# Altium schematic sheet rev1.SchDoc
size A4
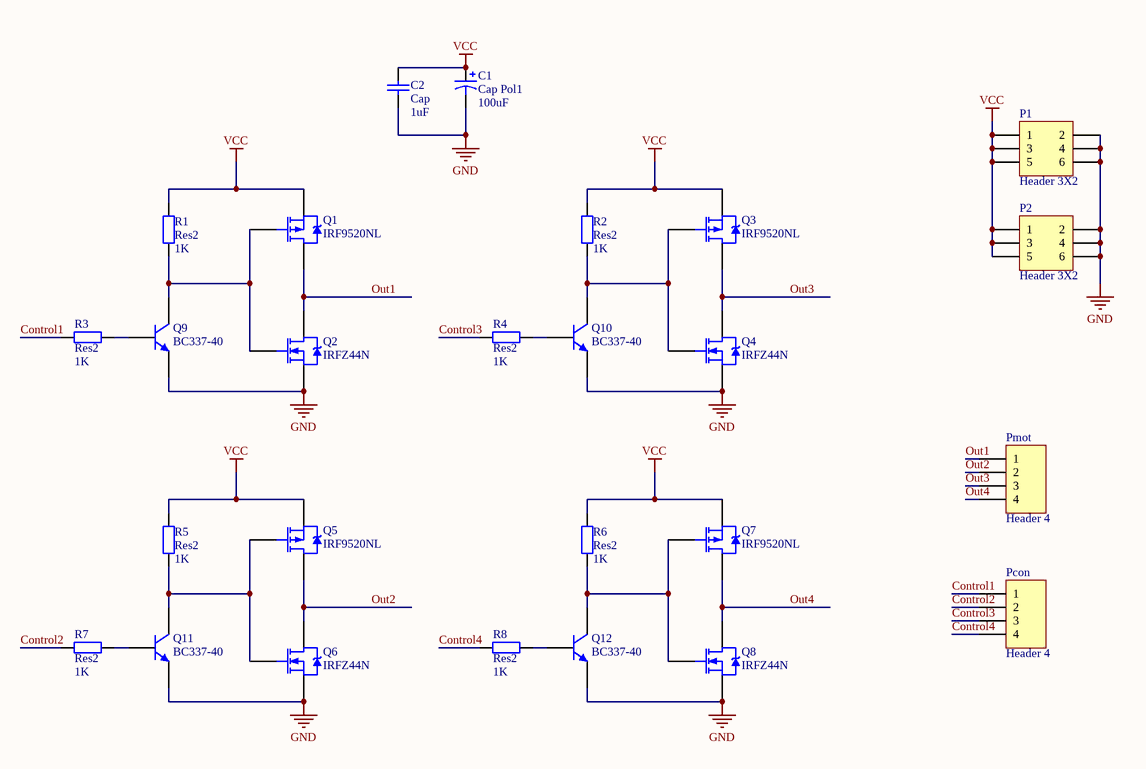
[diagram p0: rev1.SchDoc]

## Parts
C1  Cap Pol1  value 100uF  [RB5-10.5]
C2  Cap  value 1uF  [RAD-0.2]
P1  Header 3X2  [HDR2X3]
P2  Header 3X2  [HDR2X3]
Pcon  Header 4  [HDR1X4]
Pmot  Header 4  [HDR1X4]
Q1  IRF9520NL  [TO-262]
Q2  IRFZ44N  [TO-220AB]
Q3  IRF9520NL  [TO-262]
Q4  IRFZ44N  [TO-220AB]
Q5  IRF9520NL  [TO-262]
Q6  IRFZ44N  [TO-220AB]
Q7  IRF9520NL  [TO-262]
Q8  IRFZ44N  [TO-220AB]
Q9  BC337-40  [29-04]
Q10  BC337-40  [29-04]
Q11  BC337-40  [29-04]
Q12  BC337-40  [29-04]
R1  Res2  value 1K  [AXIAL-0.4]
R2  Res2  value 1K  [AXIAL-0.4]
R3  Res2  value 1K  [AXIAL-0.4]
R4  Res2  value 1K  [AXIAL-0.4]
R5  Res2  value 1K  [AXIAL-0.4]
R6  Res2  value 1K  [AXIAL-0.4]
R7  Res2  value 1K  [AXIAL-0.4]
R8  Res2  value 1K  [AXIAL-0.4]

## Nets
GND: C1.2 C2.1 P1.2 P1.4 P1.6 P2.2 P2.4 P2.6 Q2.3(S) Q4.3(S) Q6.3(S) Q8.3(S) Q9.3(E) Q10.3(E) Q11.3(E) Q12.3(E)
VCC: C1.1 C2.2 P1.1 P1.3 P1.5 P2.1 P2.3 P2.5 Q1.3(S) Q3.3(S) Q5.3(S) Q7.3(S) R1.2 R2.2 R5.2 R6.2
Control1: Pcon.1 R3.2
Control2: Pcon.2 R7.2
Control3: Pcon.3 R4.2
Control4: Pcon.4 R8.2
Out1: Pmot.1 Q1.2(D) Q2.2(D)
Out2: Pmot.2 Q5.2(D) Q6.2(D)
Out3: Pmot.3 Q3.2(D) Q4.2(D)
Out4: Pmot.4 Q7.2(D) Q8.2(D)
NetQ1_1: Q1.1(G) Q2.1(G) Q9.1(C) R1.1
NetQ3_1: Q3.1(G) Q4.1(G) Q10.1(C) R2.1
NetQ5_1: Q5.1(G) Q6.1(G) Q11.1(C) R5.1
NetQ7_1: Q7.1(G) Q8.1(G) Q12.1(C) R6.1
NetQ9_2: Q9.2(B) R3.1
NetQ10_2: Q10.2(B) R4.1
NetQ11_2: Q11.2(B) R7.1
NetQ12_2: Q12.2(B) R8.1

## Library data of the parts
C1 = Cap Pol1: Polarized Capacitor (Radial); Published: 8-Jun-2000; LatestRevisionDate: 17-Jul-2002; LatestRevisionNote: Re-released for DXP Platform.; PackageReference: RB7.6-15; Publisher: Altium Limited; PackageDescription: Polarized Capacitor (Radial); 2 Leads
C2 = Cap: Capacitor; Published: 8-Jun-2000; LatestRevisionDate: 17-Jul-2002; LatestRevisionNote: Re-released for DXP Platform.; PackageReference: RAD-0.3; Publisher: Altium Limited; PackageDescription: Radial Cap, Thru-Hole; 2 Leads; 0.3 in Pin Spacing
P1 P2 = Header 3X2: Header, 3-Pin, Dual row; LatestRevisionDate: 17-Jul-2002; LatestRevisionNote: Re-released for DXP Platform.; Publisher: Altium Limited
Pcon Pmot = Header 4: Header, 4-Pin; LatestRevisionDate: 17-Jul-2002; LatestRevisionNote: Re-released for DXP Platform.; Publisher: Altium Limited
Q1 Q3 Q5 Q7 = IRF9520NL: HEXFET Power MOSFET; Note: Pin 2 is electrically connected to pin 4 (DRAIN).; Published: 8-Jun-2000; LatestRevisionDate: 17-Jul-2002; LatestRevisionNote: Re-released for DXP Platform.; DatasheetVersion: May-1998; PackageReference: TO-262; Publisher: Altium Limited; PackageDescription: TO, Thru-Hole, Vertical, Heatsink Mounted; 3 In-Line Leads; Pitch 2.54 mm; ComponentLink1Description: Manufacturer Link; ComponentLink1URL: http://www.irf.com/; ComponentLink2Description: Datasheet; ComponentLink2URL: http://www.irf.com/product-info/datasheets/data/irf9520ns.pdf
Q2 Q4 Q6 Q8 = IRFZ44N: HEXFET Power MOSFET; Note: Pin 2 is electrically connected to pin 4.; Published: 8-Jun-2000; LatestRevisionDate: 17-Jul-2002; LatestRevisionNote: Re-released for DXP Platform.; DatasheetVersion: Aug-1997; PackageVersion: Feb-1997; PackageReference: TO-220AB; Publisher: Altium Limited; PackageDescription: TO, Thru-Hole, Vertical, Heatsink Mounted; 3 In-Line Leads; Pitch 2.54 mm; ComponentLink1Description: Manufacturer Link; ComponentLink1URL: http://www.irf.com/; ComponentLink2Description: Datasheet; ComponentLink2URL: http://www.irf.com/product-info/datasheets/data/irfz44n.pdf
Q9-Q12 = BC337-40: Amplifier Transistor NPN Silicon; Published: 29-Sep-2000; LatestRevisionDate: 17-Jul-2002; LatestRevisionNote: Re-released for DXP Platform.; DatasheetVersion: 1991; PackageVersion: 1996; PackageReference: 29-04; Publisher: Altium Limited; PackageDescription: TO, Flat Index; 3 In-Line, Axial Leads; Body Dia. 4.8mm; Leads 0.48 x 0.5 mm (max); ComponentLink1Description: Manufacturer Link; ComponentLink1URL: http://www.onsemi.com/site/products/landing?taxonomyID=194; ComponentLink2Description: Datasheet; ComponentLink2URL: http://www.onsemi.com/pub/Collateral/BC337-D.PDF
R1-R8 = Res2: Resistor; Published: 8-Jun-2000; LatestRevisionDate: 17-Jul-2002; LatestRevisionNote: Re-released for DXP Platform.; PackageReference: AXIAL-0.4; Publisher: Altium Limited; PackageDescription: Axial Device, Thru-Hole; 2 Leads; 0.4 in Pin Spacing